# Altium project NOT.PrjPcb
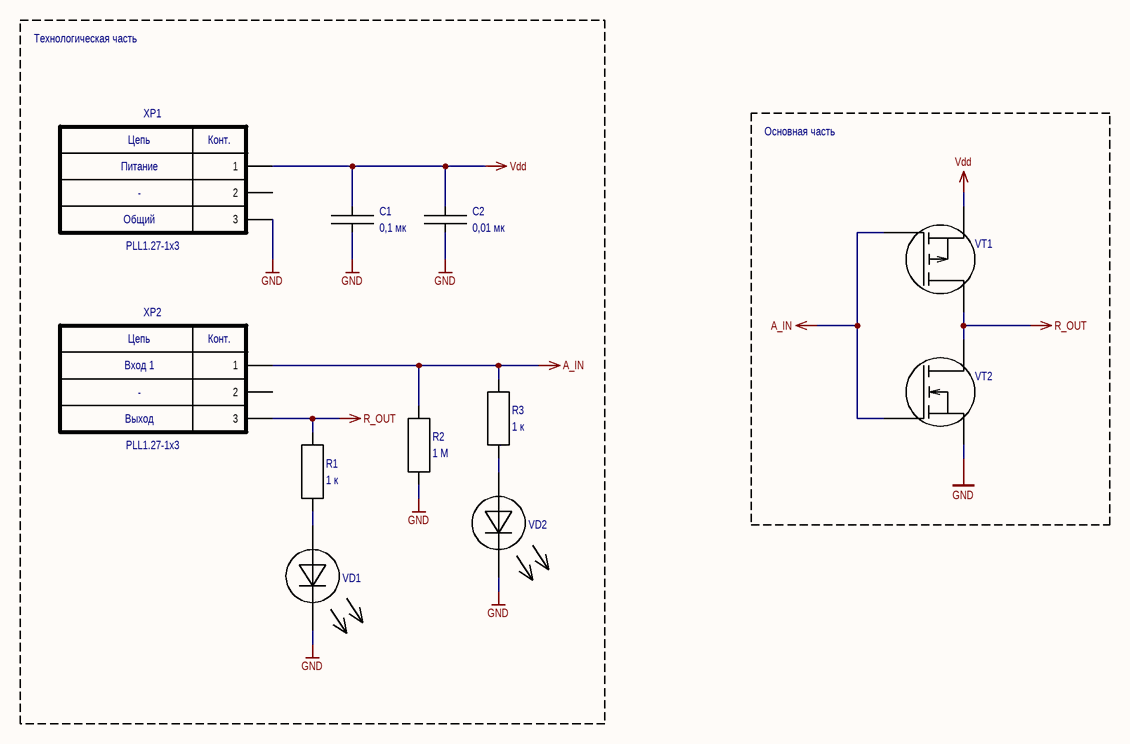
[diagram p0: Sheet5.SchDoc]
1 sheet, 11 parts. Net scope: global (net labels, ports and power ports of the same name join across sheets).
Board file: NOT.PcbDoc

## Sheet Sheet5.SchDoc
size 420 x 297 mm; SheetNumber: 1; SheetTotal: 1

### Parts
C1  value 0,1 мк  [K10-79_1.6_0.8(0603)]  (hidden comment: 0,1 мкФ ±* * * *, *)
C2  value 0,01 мк  [K10-79_1.6_0.8(0603)]  (hidden comment: 0,01 мкФ ±* * * *, *)
R1  value 1 к  [P1-12-0.1(0603)]
R2  value 1 М  [P1-12-0.1(0603)]
R3  value 1 к  [P1-12-0.1(0603)]
VD1  VD - Светодиод  [LED 0603]  (value not drawn)
VD2  VD - Светодиод  [LED 0603]  (value not drawn)
VT1  VT - Полевой транзистор P канал (MOSFET_P)  [SOT23(KT-46)]  (value not drawn)
VT2  VT - Полевой транзистор N канал (MOSFET_N)  [SOT23(KT-46)]  (value not drawn)
XP1  1: Питание  3: Общий  PartNumber: PLL1.27-1x3  [PCBComponent_1]  (hidden comment: Вилка PLL1.27-1x3 RUICHI)
XP2  1: Вход 1  3: Выход  PartNumber: PLL1.27-1x3  [PCBComponent_1]  (hidden comment: KONT_POLE_POWER)

### Blocks framed on the sheet
Технологическая часть: C1 C2 R1-R3 VD1 VD2 XP1 XP2
Основная часть: VT1 VT2

### Nets
A_IN: R2.1 R3.1 VT1.3 VT2.3 XP2.1
GND: C1.1 C2.1 R2.2 VD1.2(C) VD2.2(C) VT2.2 XP1.3
R_OUT: R1.1 VT1.2 VT2.1 XP2.3
Vdd: C1.2 C2.2 VT1.1 XP1.1
NetR1_2: R1.2 VD1.1(A)
NetR3_2: R3.2 VD2.1(A)

Not connected (* = marked no-connect by the designer): XP1 2; XP2 2

### Notes on the sheet
- Перв.примен.
- Справ. №
- Подп. и дата
- Инв.№ дубл.
- Взам. инв. №
- Изм.
- Лист
- № докум.
- Подп.
- Дата
- Лит.
- Масса
- Масштаб
- Пров.
- Т.контр
- Разраб.
- Схема электрическая принципиальная
- 1
- Листов
- Инв № подл.
- Н.контр.
- Утв.
- Копировал
- Формат А3
- (in symbol X - Контактное поле х3) Цепь; Конт.

### Library data of the parts
C1 C2 = C - Конденсатор: Company: *; PartNumber: *; Tolerance: *; Voltage: *; Type: *; Package: *
R1-R3 = R - Резистор: PartNumber: RC0603JR-071KL; Company: Yageo; Tolerance: 5 %; Package: 0603
VD1 VD2 = VD - Светодиод: PartNumber: GNL-0805UBC-TL; Company: G-nor; Value: GNL-0805UBC-TL; Package: 0603
VT1 = VT - Полевой транзистор P канал (MOSFET_P): VT; pin to pad: 1>2 2>3 3>1
VT2 = VT - Полевой транзистор N канал (MOSFET_N): VT; pin to pad: 1>3 3>1
XP1 = X - Контактное поле х3: 2: -; Company: RUICHI; Value: PLL1.27-1x3
XP2 = X - Контактное поле х3: Company: RUICHI; Value: PLL1.27-1x3; 2: -